# Altium schematic sheet МПСУ-46342.21-004 Э3 Лист8.SchDoc
size 297 x 209 mm; Address1: Address1; Address2: Address2; Address3: Address3; Address4: Address4; SheetNumber: 1; DocumentTypeSCH: Э3
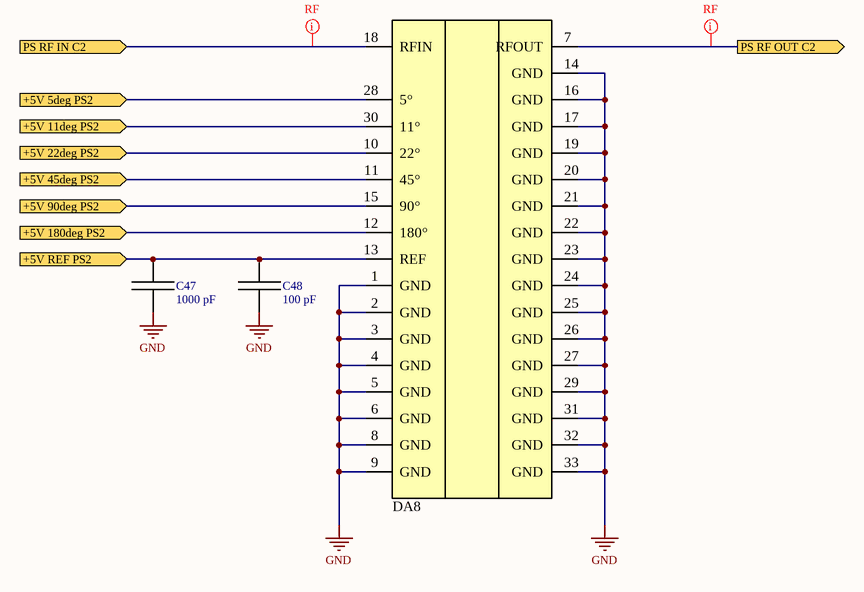
[diagram p0: МПСУ-46342.21-004 Э3 Лист8.SchDoc]

## Parts
C47  1000 pF  [CAPC100X50X55L20N]
C48  100 pF  [CAPC100X50X55L20N]
DA8  TGP2105-SM  [QFN33P50_500X500X80L46X25T340N]  (value not drawn)

## Ports
+5V 5deg PS2 (in), +5V 11deg PS2 (in), +5V 22deg PS2 (in), +5V 45deg PS2 (in), +5V 90deg PS2 (in), +5V 180deg PS2 (in), +5V REF PS2 (in), PS RF IN C2 (in), PS RF OUT C2 (out)

## Nets
GND: C47.1 C48.1 DA8.1(GND) DA8.2(GND) DA8.3(GND) DA8.4(GND) DA8.5(GND) DA8.6(GND) DA8.8(GND) DA8.9(GND) DA8.14(GND) DA8.16(GND) DA8.17(GND) DA8.19(GND) DA8.20(GND) DA8.21(GND) DA8.22(GND) DA8.23(GND) DA8.24(GND) DA8.25(GND) DA8.26(GND) DA8.27(GND) DA8.29(GND) DA8.31(GND) DA8.32(GND) DA8.33(GND)
+5V 5deg PS2: DA8.28(5°) ; port +5V 5deg PS2
+5V 11deg PS2: DA8.30(11°) ; port +5V 11deg PS2
+5V 22deg PS2: DA8.10(22°) ; port +5V 22deg PS2
+5V 45deg PS2: DA8.11(45°) ; port +5V 45deg PS2
+5V 90deg PS2: DA8.15(90°) ; port +5V 90deg PS2
+5V 180deg PS2: DA8.12(180°) ; port +5V 180deg PS2
+5V REF PS2: C47.2 C48.2 DA8.13(REF) ; port +5V REF PS2
PS RF IN C2: DA8.18(RFIN) ; port PS RF IN C2
PS RF OUT C2: DA8.7(RFOUT) ; port PS RF OUT C2

## Layout directives
net class RF: PS RF IN C2, PS RF OUT C2

## Notes on the sheet
- Подп. и дата
- Инв. № дубл.
- Взам. инв. №
- Инв. № подл.
- Изм.
- Лист
- № докум.
- Подп.
- Дата
- Копировал
- Формат А4

## Library data of the parts
C47 C48 = Capacitor: Capacitor, generic; Tolerance: 5 %; VDC: 20 V; PartNumber: *; Dielectric: *; Manufacturer: *; Package: 0402
  C47: Value: 1000 pF
  C48: Value: 100 pF
DA8 = TGP2105-SM 1: 6 - 18 GHz 6-Bit Digital Phase Shifter (+Vc); Manufacturer: Qorvo; PartNumber: TGP2105-SM; ComponentLink1Description: Component Page; ComponentLink1URL: https://www.qorvo.com/products/p/TGP2105-SM